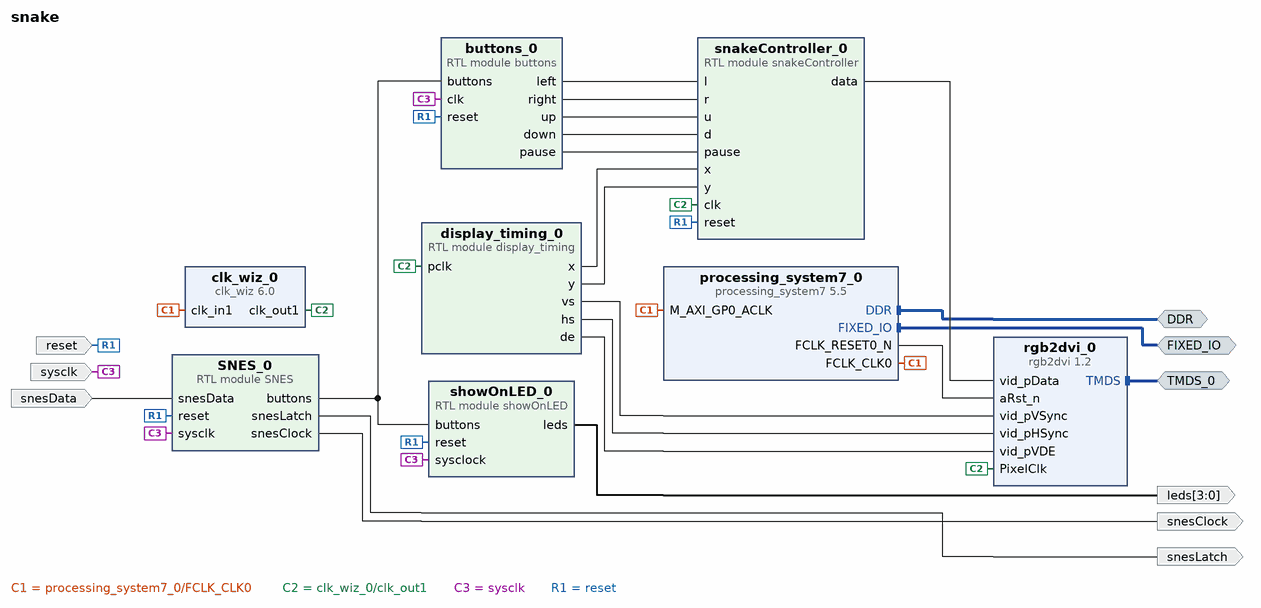
[diagram p0: block diagram of the top level]
# Vivado block design snake, xc7z020clg400-1, Vivado 2018.1
create_bd_design snake

create_bd_intf_port -mode Master -vlnv xilinx.com:interface:ddrx_rtl:1.0 DDR
create_bd_intf_port -mode Master -vlnv xilinx.com:display_processing_system7:fixedio_rtl:1.0 FIXED_IO
create_bd_intf_port -mode Master -vlnv digilentinc.com:interface:tmds_rtl:1.0 TMDS_0
create_bd_port -dir O -from 3 -to 0 leds
create_bd_port -dir I sysclk
create_bd_port -dir O snesLatch
create_bd_port -dir O snesClock
create_bd_port -dir I snesData
create_bd_port -dir I -type rst reset

create_bd_cell -type ip -vlnv xilinx.com:ip:processing_system7:5.5 processing_system7_0
set_property -dict [list \
  CONFIG.PCW_UIPARAM_DDR_FREQ_MHZ 525 \
  CONFIG.PCW_CRYSTAL_PERIPHERAL_FREQMHZ 50 \
  CONFIG.PCW_APU_PERIPHERAL_FREQMHZ 650 \
  CONFIG.PCW_SDIO_PERIPHERAL_FREQMHZ 50 \
  CONFIG.PCW_UART_PERIPHERAL_FREQMHZ 100 \
  CONFIG.PCW_FPGA0_PERIPHERAL_FREQMHZ 100 \
  CONFIG.PCW_FPGA1_PERIPHERAL_FREQMHZ 50 \
  CONFIG.PCW_M_AXI_GP0_FREQMHZ 10 \
  CONFIG.PCW_PERIPHERAL_BOARD_PRESET None \
  CONFIG.PCW_PRESET_BANK1_VOLTAGE {LVCMOS 1.8V} \
  CONFIG.PCW_UIPARAM_DDR_BUS_WIDTH {16 Bit} \
  CONFIG.PCW_UIPARAM_DDR_PARTNO {MT41J256M16 RE-125} \
  CONFIG.PCW_QSPI_PERIPHERAL_ENABLE 1 \
  CONFIG.PCW_QSPI_QSPI_IO {MIO 1 .. 6} \
  CONFIG.PCW_QSPI_GRP_SINGLE_SS_ENABLE 1 \
  CONFIG.PCW_QSPI_GRP_SINGLE_SS_IO {MIO 1 .. 6} \
  CONFIG.PCW_SINGLE_QSPI_DATA_MODE x4 \
  CONFIG.PCW_QSPI_GRP_FBCLK_ENABLE 1 \
  CONFIG.PCW_QSPI_GRP_FBCLK_IO {MIO 8} \
  CONFIG.PCW_ENET0_PERIPHERAL_ENABLE 1 \
  CONFIG.PCW_ENET0_ENET0_IO {MIO 16 .. 27} \
  CONFIG.PCW_ENET0_GRP_MDIO_ENABLE 1 \
  CONFIG.PCW_ENET0_GRP_MDIO_IO {MIO 52 .. 53} \
  CONFIG.PCW_ENET_RESET_ENABLE 1 \
  CONFIG.PCW_ENET_RESET_SELECT {Share reset pin} \
  CONFIG.PCW_ENET0_RESET_ENABLE 1 \
  CONFIG.PCW_ENET0_RESET_IO {MIO 9} \
  CONFIG.PCW_SD0_PERIPHERAL_ENABLE 1 \
  CONFIG.PCW_SD0_SD0_IO {MIO 40 .. 45} \
  CONFIG.PCW_SD0_GRP_CD_ENABLE 1 \
  CONFIG.PCW_SD0_GRP_CD_IO {MIO 47} \
  CONFIG.PCW_SD0_GRP_WP_ENABLE 0 \
  CONFIG.PCW_UART0_PERIPHERAL_ENABLE 1 \
  CONFIG.PCW_UART0_UART0_IO {MIO 14 .. 15} \
  CONFIG.PCW_UART1_PERIPHERAL_ENABLE 0 \
  CONFIG.PCW_USB0_PERIPHERAL_ENABLE 1 \
  CONFIG.PCW_USB0_USB0_IO {MIO 28 .. 39} \
  CONFIG.PCW_USB_RESET_ENABLE 1 \
  CONFIG.PCW_USB_RESET_SELECT {Share reset pin} \
  CONFIG.PCW_USB0_RESET_ENABLE 1 \
  CONFIG.PCW_USB0_RESET_IO {MIO 46} \
  CONFIG.PCW_I2C_RESET_ENABLE 1 \
  CONFIG.PCW_GPIO_MIO_GPIO_ENABLE 1 \
  CONFIG.PCW_GPIO_MIO_GPIO_IO MIO \
] [get_bd_cells processing_system7_0]
# 481 more settings of processing_system7_0 are not shown: defaults, MIO pin electricals, DDR timing, and values the tool derives
create_bd_cell -type ip -vlnv digilentinc.com:ip:rgb2dvi:1.2 rgb2dvi_0
set_property -dict {CONFIG.kRstActiveHigh false CONFIG.kClkRange 2} [get_bd_cells rgb2dvi_0]
create_bd_cell -type ip -vlnv xilinx.com:ip:clk_wiz:6.0 clk_wiz_0
set_property -dict [list \
  CONFIG.CLKOUT1_REQUESTED_OUT_FREQ 74.25 \
  CONFIG.USE_LOCKED false \
  CONFIG.USE_RESET false \
  CONFIG.MMCM_DIVCLK_DIVIDE 4 \
  CONFIG.MMCM_CLKFBOUT_MULT_F 37.125 \
  CONFIG.MMCM_CLKOUT0_DIVIDE_F 12.500 \
  CONFIG.CLKOUT1_JITTER 245.495 \
  CONFIG.CLKOUT1_PHASE_ERROR 245.344 \
] [get_bd_cells clk_wiz_0]
create_bd_cell -type module -reference display_timing display_timing_0
create_bd_cell -type module -reference SNES SNES_0
create_bd_cell -type module -reference showOnLED showOnLED_0
create_bd_cell -type module -reference buttons buttons_0
create_bd_cell -type module -reference snakeController snakeController_0

# ---- connections ----

connect_bd_intf_net [get_bd_intf_ports DDR] [get_bd_intf_pins processing_system7_0/DDR]
connect_bd_intf_net [get_bd_intf_ports FIXED_IO] [get_bd_intf_pins processing_system7_0/FIXED_IO]
connect_bd_intf_net [get_bd_intf_ports TMDS_0] [get_bd_intf_pins rgb2dvi_0/TMDS]
connect_bd_net [get_bd_pins processing_system7_0/FCLK_CLK0] [get_bd_pins clk_wiz_0/clk_in1] [get_bd_pins processing_system7_0/M_AXI_GP0_ACLK]
connect_bd_net [get_bd_pins clk_wiz_0/clk_out1] \
  [get_bd_pins display_timing_0/pclk] [get_bd_pins rgb2dvi_0/PixelClk] [get_bd_pins snakeController_0/clk]
connect_bd_net [get_bd_pins display_timing_0/vs] [get_bd_pins rgb2dvi_0/vid_pVSync]
connect_bd_net [get_bd_pins display_timing_0/hs] [get_bd_pins rgb2dvi_0/vid_pHSync]
connect_bd_net [get_bd_pins display_timing_0/de] [get_bd_pins rgb2dvi_0/vid_pVDE]
connect_bd_net [get_bd_pins showOnLED_0/leds] [get_bd_ports leds]
connect_bd_net -net sysclk_0_1 [get_bd_ports sysclk] [get_bd_pins SNES_0/sysclk] [get_bd_pins showOnLED_0/sysclock] [get_bd_pins buttons_0/clk]
connect_bd_net [get_bd_pins SNES_0/snesLatch] [get_bd_ports snesLatch]
connect_bd_net [get_bd_pins SNES_0/snesClock] [get_bd_ports snesClock]
connect_bd_net -net snesData_0_1 [get_bd_ports snesData] [get_bd_pins SNES_0/snesData]
connect_bd_net [get_bd_pins display_timing_0/x] [get_bd_pins snakeController_0/x]
connect_bd_net [get_bd_pins display_timing_0/y] [get_bd_pins snakeController_0/y]
connect_bd_net [get_bd_pins buttons_0/left] [get_bd_pins snakeController_0/l]
connect_bd_net [get_bd_pins buttons_0/right] [get_bd_pins snakeController_0/r]
connect_bd_net [get_bd_pins buttons_0/up] [get_bd_pins snakeController_0/u]
connect_bd_net [get_bd_pins buttons_0/down] [get_bd_pins snakeController_0/d]
connect_bd_net [get_bd_pins snakeController_0/data] [get_bd_pins rgb2dvi_0/vid_pData]
connect_bd_net [get_bd_pins SNES_0/buttons] [get_bd_pins showOnLED_0/buttons] [get_bd_pins buttons_0/buttons]
connect_bd_net [get_bd_ports reset] \
  [get_bd_pins showOnLED_0/reset] [get_bd_pins SNES_0/reset] [get_bd_pins buttons_0/reset] \
  [get_bd_pins snakeController_0/reset]
connect_bd_net [get_bd_pins processing_system7_0/FCLK_RESET0_N] [get_bd_pins rgb2dvi_0/aRst_n]
connect_bd_net [get_bd_pins buttons_0/pause] [get_bd_pins snakeController_0/pause]

validate_bd_design
save_bd_design
